# Altium project BleDemoBoard.PrjPcb
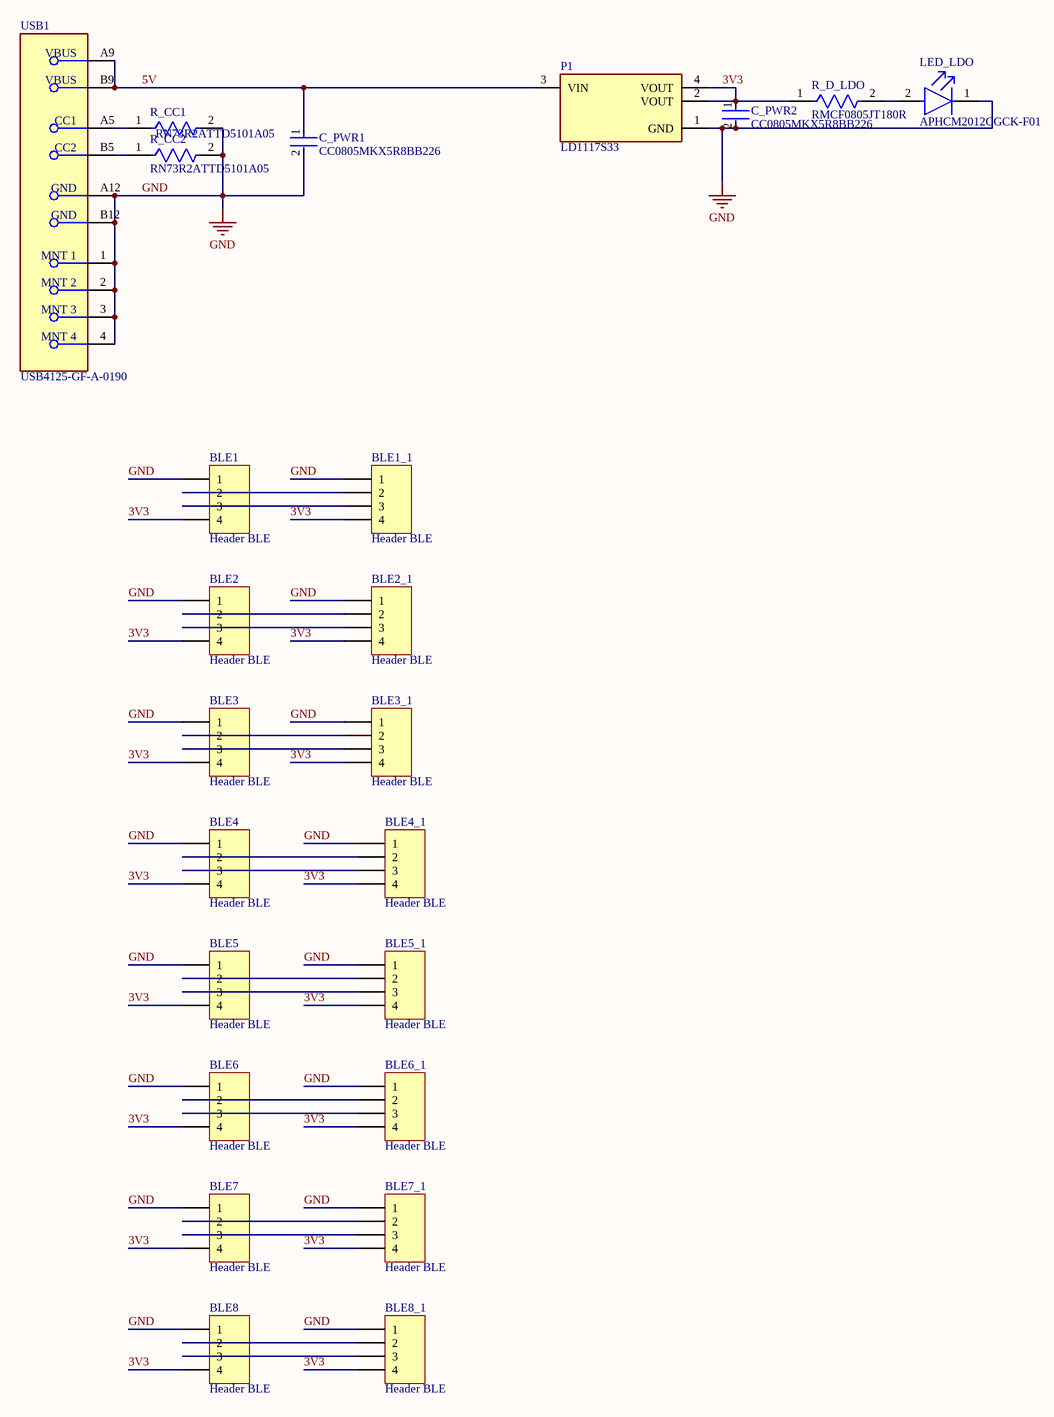
[diagram p0: BleDemoBoard.SchDoc]
1 sheet, 24 parts. Net scope: global (net labels, ports and power ports of the same name join across sheets).
Board file: BleDemoBoard.PcbDoc

## Sheet BleDemoBoard.SchDoc
size C; SheetNumber: 1; SheetTotal: 1

### Parts
BLE1  Header BLE  [HDR1X4]
BLE1_1  Header BLE  [HDR1X4]
BLE2  Header BLE  [HDR1X4]
BLE2_1  Header BLE  [HDR1X4]
BLE3  Header BLE  [HDR1X4]
BLE3_1  Header BLE  [HDR1X4]
BLE4  Header BLE  [HDR1X4]
BLE4_1  Header BLE  [HDR1X4]
BLE5  Header BLE  [HDR1X4]
BLE5_1  Header BLE  [HDR1X4]
BLE6  Header BLE  [HDR1X4]
BLE6_1  Header BLE  [HDR1X4]
BLE7  Header BLE  [HDR1X4]
BLE7_1  Header BLE  [HDR1X4]
BLE8  Header BLE  [HDR1X4]
BLE8_1  Header BLE  [HDR1X4]
C_PWR1  CC0805MKX5R8BB226  [FP-CC0805-0_2-1_45-IPC_C]
C_PWR2  CC0805MKX5R8BB226  [FP-CC0805-0_2-1_45-IPC_C]
LED_LDO  APHCM2012CGCK-F01  [FP-APHCM2012CGCK-F01-MFG]
P1  LD1117S33  [FP-SOT-223-0046067_14-MFG]
R_CC1  RN73R2ATTD5101A05  [FP-RN73R2A-IPC_C]
R_CC2  RN73R2ATTD5101A05  [FP-RN73R2A-IPC_C]
R_D_LDO  RMCF0805JT180R  [FP-RMCF0805-IPC_B]
USB1  USB4125-GF-A-0190  [FP-USB4125-GF-A-0190-MFG]

### Nets
GND: BLE1.1 BLE1_1.1 BLE2.1 BLE2_1.1 BLE3.1 BLE3_1.1 BLE4.1 BLE4_1.1 BLE5.1 BLE5_1.1 BLE6.1 BLE6_1.1 BLE7.1 BLE7_1.1 BLE8.1 BLE8_1.1 C_PWR1.2 C_PWR2.2 LED_LDO.1(C) P1.1(GND) R_CC1.2 R_CC2.2 USB1.1(MNT_1) USB1.2(MNT_2) USB1.3(MNT_3) USB1.4(MNT_4) USB1.A12(GND) USB1.B12(GND)
3V3: BLE1.4 BLE1_1.4 BLE2.4 BLE2_1.4 BLE3.4 BLE3_1.4 BLE4.4 BLE4_1.4 BLE5.4 BLE5_1.4 BLE6.4 BLE6_1.4 BLE7.4 BLE7_1.4 BLE8.4 BLE8_1.4 C_PWR2.1 P1.2(VOUT) P1.4(VOUT) R_D_LDO.1
5V: C_PWR1.1 P1.3(VIN) USB1.A9(VBUS) USB1.B9(VBUS)
NetBLE1_2: BLE1.2 BLE1_1.2
NetBLE1_3: BLE1.3 BLE1_1.3
NetBLE2_2: BLE2.2 BLE2_1.2
NetBLE2_3: BLE2.3 BLE2_1.3
NetBLE3_2: BLE3.2 BLE3_1.2
NetBLE3_3: BLE3.3 BLE3_1.3
NetBLE4_2: BLE4.2 BLE4_1.2
NetBLE4_3: BLE4.3 BLE4_1.3
NetBLE5_2: BLE5.2 BLE5_1.2
NetBLE5_3: BLE5.3 BLE5_1.3
NetBLE6_2: BLE6.2 BLE6_1.2
NetBLE6_3: BLE6.3 BLE6_1.3
NetBLE7_2: BLE7.2 BLE7_1.2
NetBLE7_3: BLE7.3 BLE7_1.3
NetBLE8_2: BLE8.2 BLE8_1.2
NetBLE8_3: BLE8.3 BLE8_1.3
NetLED_LDO_2: LED_LDO.2(A) R_D_LDO.2
NetR_CC1_1: R_CC1.1 USB1.A5(CC1)
NetR_CC2_1: R_CC2.1 USB1.B5(CC2)

### Library data of the parts
BLE1 BLE1_1 BLE2 BLE2_1 BLE3 BLE3_1 BLE4 BLE4_1 BLE5 BLE5_1 BLE6 BLE6_1 BLE7 BLE7_1 BLE8 BLE8_1 = Header 4: Header, 4-Pin; LatestRevisionDate: 17-Jul-2002; LatestRevisionNote: Re-released for DXP Platform.; Publisher: Altium Limited
C_PWR1 C_PWR2 = CMP-03422-001497-1: CAP CER 22UF 25V X5R 0805; Tolerance: 20%; Max Operating Temperature: 85°C; Dielectric: X5R; Termination: SMD/SMT; Voltage Rating: 25V; Width: 0.049inch; Min Operating Temperature: -55°C; Case/Package: 0805; Lead Free: Lead Free; RoHS Compliant: Yes; Weight: 0.000194oz; Voltage Rating (DC): 25V; Capacitance: 22uF; Length: 0.079inch; Halogen Free: Halogen Free; Height: 1.25mm; Packaging: Tape and Reel; Package Quantity: 3000; Case Code (Metric): 2012; Thickness: 0.057inch; Case Code (Imperial): 0805; Mount: Surface Mount
LED_LDO = CMP-44529-000062-1: LED GREEN CLEAR CHIP SMD; Dominant Wavelength: 570nm; Forward Current: 20mA; Number of LEDs: 1; Luminous Intensity: 40mcd; Forward Voltage: 2.1V; Viewing Angle: 110°; Illumination Color: Green; Lens Style: Clear; Mount: Surface Mount; Length: 2mm; Max Operating Temperature: 85°C; Series: APHCM; Width: 1.25mm; Lead Free: Lead Free; Wavelength: 570nm; Package Quantity: 1; Number of Pins: 2; Case Code (Metric): 2012; RoHS Compliant: Yes; Packaging: Tape and Reel; Lens Color: Clear; Case/Package: 0805; Case Code (Imperial): 0805; Test Current: 20mA; Color: Green; Min Operating Temperature: -40°C; Height: 0.4mm
P1 = CMP-0244-00307-2: IC REG LINEAR 3.3V 800MA SOT223; Input Bias Current: 5mA; Output Voltage Accuracy: 1%; Dropout Voltage: 1.1V; Power Dissipation: 12W; Polarity: Positive; Min Input Voltage: 5.3V; Quiescent Current: 10mA; Max Output Current: 1.3A; Output Current: 950mA; Number of Regulators: 1; Max Supply Voltage: 15V; Output Type: Fixed; Output Voltage: 3.3V; Number of Terminals: 4; Min Supply Voltage: 3.3V; Termination: SMD/SMT; Mount: Surface Mount; Max Power Dissipation: 12W; Case/Package: SOT-223; Lead Free: Lead Free; Height: 1.8mm; REACH SVHC: No SVHC; Radiation Hardening: No; Width: 3.5mm; Length: 6.5mm; Packaging: Tape and Reel; Max Input Voltage: 15V; Accuracy: 1%; Weight: 0.01lb; Contact Plating: Tin; Max Operating Temperature: 125°C; Number of Pins: 4; Max Output Voltage: 3.3V; Min Operating Temperature: -40°C; Nominal Output Voltage: 3.3V; Package Quantity: 1; Min Output Voltage: 3.3V; Number of Outputs: 1
R_CC1 R_CC2 = CMP-04015-014497-1: 5.1kΩ ±0.05% 0.125W, 1/8W Chip Resistor 0805 (2012 Metric) Moisture Resistant Thin Film
R_D_LDO = CMP-26527-003283-1: 180Ω ±5% 0.125W 0805 Thick Film Chip Resistor AEC-Q200 compliant; Max Power Dissipation: 125mW; Temperature Coefficient: 200ppm/°C; Resistance: 180R; Case Code (Imperial): 0805; Height: 0.026inch; Case Code (Metric): 2012; Length: 0.079inch; Series: RMCF; Lead Free: Lead Free; Number of Terminations: 2; Military Standard: Not; Packaging: Tape and Reel; Case/Package: 0805; Mount: Surface Mount; Resistor Type: Thick Film; Radiation Hardening: No; Features: Automotive AEC-Q200; Construction: Rectangular; Tolerance: 5%; Contact Plating: Tin; RoHS Compliant: Yes; Min Operating Temperature: -55°C; Depth: 1.25mm; Max Operating Temperature: 155°C; Width: 0.049inch
USB1 = CMP-245163-000004-1: CONN RCPT TYPE C 6P SMD RA